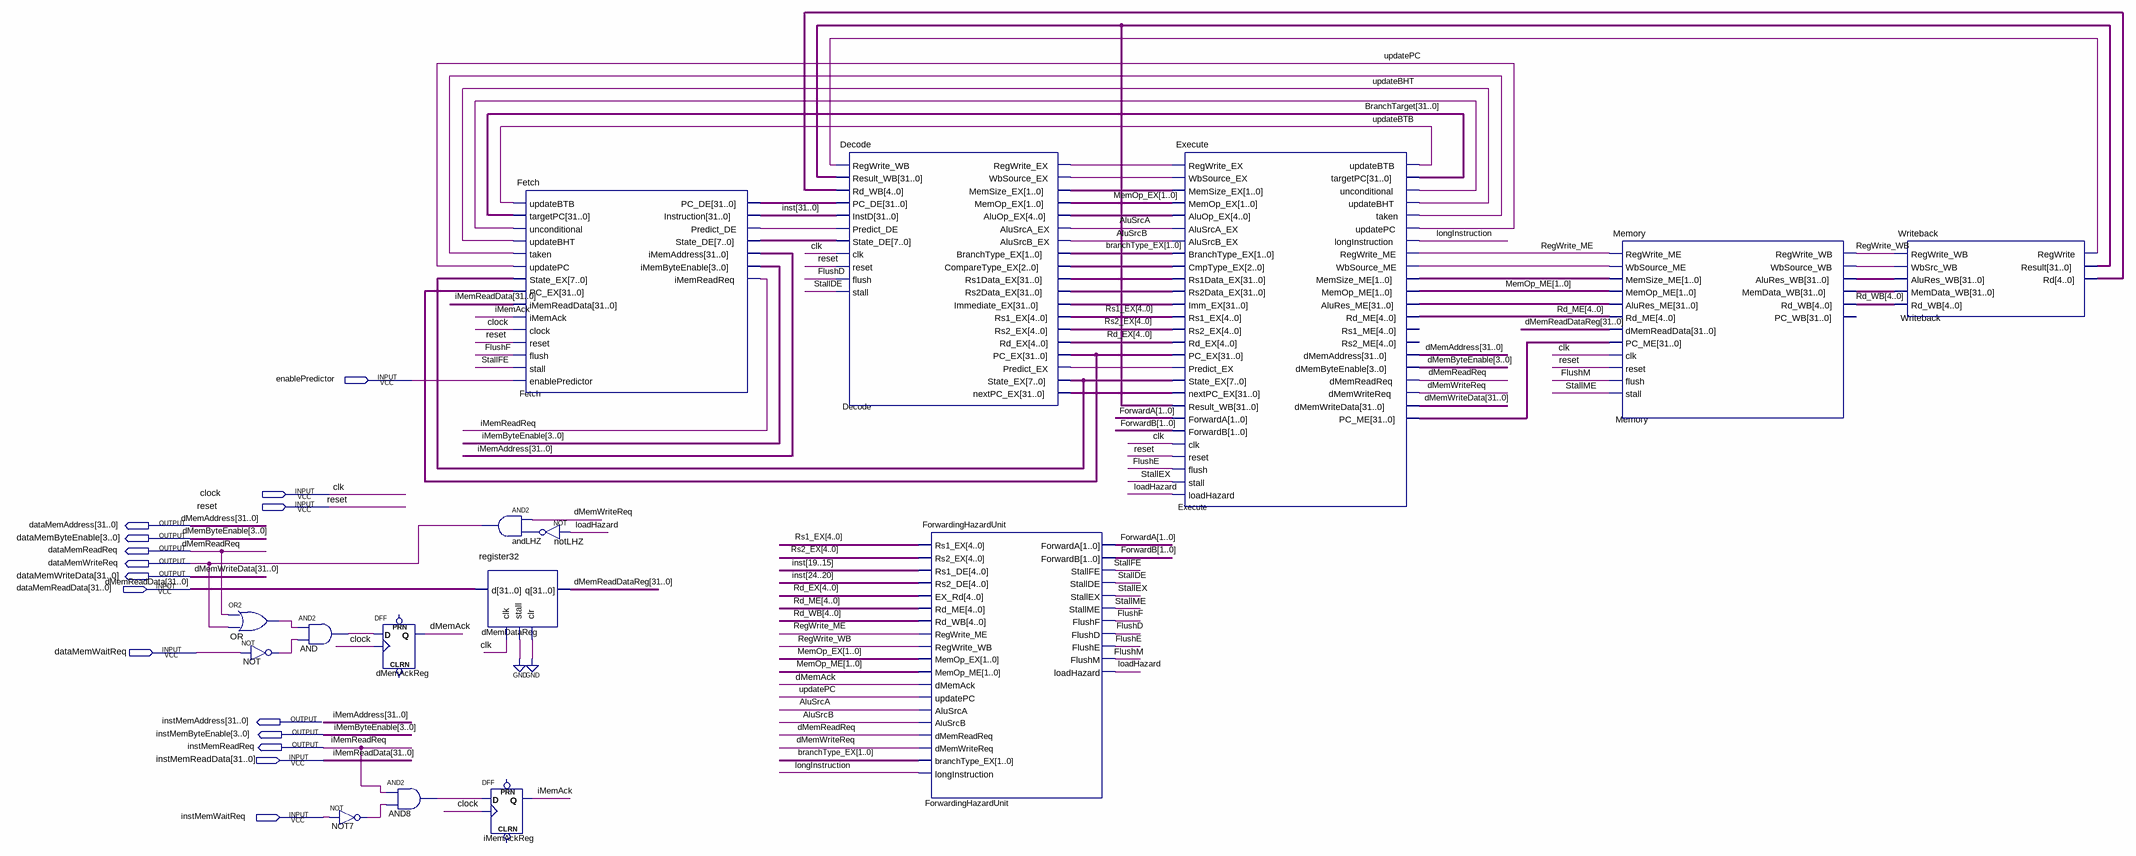
[diagram p0: schematic sheet]
// Quartus schematic Core.bdf as structural Verilog: 16 symbols, 15 pins
module Core (
  input  enablePredictor,
  input  clock,
  input  reset,
  input  [31:0] dataMemReadData,
  input  dataMemWaitReq,
  input  [31:0] instMemReadData,
  input  instMemWaitReq,
  output [31:0] dataMemAddress,
  output [3:0] dataMemByteEnable,
  output dataMemReadReq,
  output dataMemWriteReq,
  output [31:0] dataMemWriteData,
  output [31:0] instMemAddress,
  output [3:0] instMemByteEnable,
  output instMemReadReq
);

  wire AluSrcA, AluSrcB, AND8_out, AND_out, Decode_predict_ex, Decode_regwrite_ex, Decode_wbsource_ex,
       dMemAck, dMemWriteReq, Execute_taken, Execute_unconditional, Execute_wbsource_me, Fetch_predict_de,
       FlushD, FlushE, FlushF, FlushM, iMemAck, loadHazard, longInstruction, Memory_wbsource_wb, NOT7_out,
       NOT_out, notLHZ_out, OR_out, RegWrite_ME, RegWrite_WB, StallDE, StallEX, StallFE, StallME, updateBHT,
       updateBTB, updatePC, Writeback_regwrite;
  wire [1:0] branchType_EX, Decode_memsize_ex, Execute_memsize_me, ForwardA, ForwardB, MemOp_EX, MemOp_ME;
  wire [2:0] Decode_comparetype_ex;
  wire [4:0] Decode_aluop_ex, Rd_EX, Rd_ME, Rd_WB, Rs1_EX, Rs2_EX, Writeback_rd;
  wire [7:0] Decode_state_ex, Fetch_state_de;
  wire [31:0] BranchTarget, Decode_immediate_ex, Decode_nextpc_ex, Decode_pc_ex, Decode_rs1data_ex,
       Decode_rs2data_ex, dMemReadDataReg, Execute_alures_me, Execute_pc_me, Fetch_pc_de, inst,
       Memory_alures_wb, Memory_memdata_wb, Writeback_result;

  or OR (OR_out, dataMemReadReq, dataMemWriteReq);
  not NOT (NOT_out, dataMemWaitReq);
  and AND (AND_out, OR_out, NOT_out);
  not NOT7 (NOT7_out, instMemWaitReq);
  DFF dMemAckReg (.CLK(clock), .D(AND_out), .Q(dMemAck));  // open: CLRN, PRN
  and AND8 (AND8_out, instMemReadReq, NOT7_out);
  and andLHZ (dataMemWriteReq, dMemWriteReq, notLHZ_out);
  register32 dMemDataReg (.d(dataMemReadData), .stall(1'b0), .clr(1'b0), .clk(clock), .q(dMemReadDataReg));
  DFF iMemAckReg (.CLK(clock), .D(AND8_out), .Q(iMemAck));  // open: CLRN, PRN
  Fetch Fetch (
    .updateBTB(updateBTB), .targetPC(BranchTarget), .unconditional(Execute_unconditional),
    .updateBHT(updateBHT), .taken(Execute_taken), .updatePC(updatePC), .State_EX(Decode_state_ex),
    .PC_EX(Decode_pc_ex), .iMemReadData(instMemReadData), .iMemAck(iMemAck), .clock(clock), .reset(reset),
    .flush(FlushF), .stall(StallFE), .enablePredictor(enablePredictor), .PC_DE(Fetch_pc_de),
    .Instruction(inst), .Predict_DE(Fetch_predict_de), .State_DE(Fetch_state_de),
    .iMemAddress(instMemAddress), .iMemByteEnable(instMemByteEnable), .iMemReadReq(instMemReadReq));
  not notLHZ (notLHZ_out, loadHazard);
  Decode Decode (
    .RegWrite_WB(Writeback_regwrite), .Result_WB(Writeback_result), .Rd_WB(Writeback_rd),
    .PC_DE(Fetch_pc_de), .InstD(inst), .Predict_DE(Fetch_predict_de), .State_DE(Fetch_state_de), .clk(clock),
    .reset(reset), .flush(FlushD), .stall(StallDE), .RegWrite_EX(Decode_regwrite_ex),
    .WbSource_EX(Decode_wbsource_ex), .MemSize_EX(Decode_memsize_ex), .MemOp_EX(MemOp_EX),
    .AluOp_EX(Decode_aluop_ex), .AluSrcA_EX(AluSrcA), .AluSrcB_EX(AluSrcB), .BranchType_EX(branchType_EX),
    .CompareType_EX(Decode_comparetype_ex), .Rs1Data_EX(Decode_rs1data_ex), .Rs2Data_EX(Decode_rs2data_ex),
    .Immediate_EX(Decode_immediate_ex), .Rs1_EX(Rs1_EX), .Rs2_EX(Rs2_EX), .Rd_EX(Rd_EX),
    .PC_EX(Decode_pc_ex), .Predict_EX(Decode_predict_ex), .State_EX(Decode_state_ex),
    .nextPC_EX(Decode_nextpc_ex));
  ForwardingHazardUnit ForwardingHazardUnit (
    .Rs1_EX(Rs1_EX), .Rs2_EX(Rs2_EX), .Rs1_DE(inst[19:15]), .Rs2_DE(inst[24:20]), .EX_Rd(Rd_EX),
    .Rd_ME(Rd_ME), .Rd_WB(Rd_WB), .RegWrite_ME(RegWrite_ME), .RegWrite_WB(RegWrite_WB), .MemOp_EX(MemOp_EX),
    .MemOp_ME(MemOp_ME), .dMemAck(dMemAck), .updatePC(updatePC), .AluSrcA(AluSrcA), .AluSrcB(AluSrcB),
    .dMemReadReq(dataMemReadReq), .dMemWriteReq(dMemWriteReq), .branchType_EX(branchType_EX),
    .longInstruction(longInstruction), .ForwardA(ForwardA), .ForwardB(ForwardB), .StallFE(StallFE),
    .StallDE(StallDE), .StallEX(StallEX), .StallME(StallME), .FlushF(FlushF), .FlushD(FlushD),
    .FlushE(FlushE), .FlushM(FlushM), .loadHazard(loadHazard));
  Execute Execute (
    .RegWrite_EX(Decode_regwrite_ex), .WbSource_EX(Decode_wbsource_ex), .MemSize_EX(Decode_memsize_ex),
    .MemOp_EX(MemOp_EX), .AluOp_EX(Decode_aluop_ex), .AluSrcA_EX(AluSrcA), .AluSrcB_EX(AluSrcB),
    .BranchType_EX(branchType_EX), .CmpType_EX(Decode_comparetype_ex), .Rs1Data_EX(Decode_rs1data_ex),
    .Rs2Data_EX(Decode_rs2data_ex), .Imm_EX(Decode_immediate_ex), .Rs1_EX(Rs1_EX), .Rs2_EX(Rs2_EX),
    .Rd_EX(Rd_EX), .PC_EX(Decode_pc_ex), .Predict_EX(Decode_predict_ex), .State_EX(Decode_state_ex),
    .nextPC_EX(Decode_nextpc_ex), .Result_WB(Writeback_result), .ForwardA(ForwardA), .ForwardB(ForwardB),
    .clk(clock), .reset(reset), .flush(FlushE), .stall(StallEX), .loadHazard(loadHazard),
    .updateBTB(updateBTB), .targetPC(BranchTarget), .unconditional(Execute_unconditional),
    .updateBHT(updateBHT), .taken(Execute_taken), .updatePC(updatePC), .longInstruction(longInstruction),
    .RegWrite_ME(RegWrite_ME), .WbSource_ME(Execute_wbsource_me), .MemSize_ME(Execute_memsize_me),
    .MemOp_ME(MemOp_ME), .AluRes_ME(Execute_alures_me), .Rd_ME(Rd_ME), .dMemAddress(dataMemAddress),
    .dMemByteEnable(dataMemByteEnable), .dMemReadReq(dataMemReadReq), .dMemWriteReq(dMemWriteReq),
    .dMemWriteData(dataMemWriteData), .PC_ME(Execute_pc_me));  // open: Rs1_ME, Rs2_ME
  Memory Memory (
    .RegWrite_ME(RegWrite_ME), .WbSource_ME(Execute_wbsource_me), .MemSize_ME(Execute_memsize_me),
    .MemOp_ME(MemOp_ME), .AluRes_ME(Execute_alures_me), .Rd_ME(Rd_ME), .dMemReadData(dMemReadDataReg),
    .PC_ME(Execute_pc_me), .clk(clock), .reset(reset), .flush(FlushM), .stall(StallME),
    .RegWrite_WB(RegWrite_WB), .WbSource_WB(Memory_wbsource_wb), .AluRes_WB(Memory_alures_wb),
    .MemData_WB(Memory_memdata_wb), .Rd_WB(Rd_WB));  // open: PC_WB
  Writeback Writeback (
    .RegWrite_WB(RegWrite_WB), .WbSrc_WB(Memory_wbsource_wb), .AluRes_WB(Memory_alures_wb),
    .MemData_WB(Memory_memdata_wb), .Rd_WB(Rd_WB), .RegWrite(Writeback_regwrite), .Result(Writeback_result),
    .Rd(Writeback_rd));

  // Other names for the same wires on the sheet: clk = clock; dMemAddress[31:0] = dataMemAddress;
  //   dMemByteEnable[3:0] = dataMemByteEnable; dMemReadData[31:0] = dataMemReadData; dMemReadReq = dataMemReadReq;
  //   dMemWriteData[31:0] = dataMemWriteData; iMemAddress[31:0] = instMemAddress;
  //   iMemByteEnable[3:0] = instMemByteEnable; iMemReadData[31:0] = instMemReadData; iMemReadReq = instMemReadReq
endmodule
